# EAGLE design KickerBoard6B (EAGLE 6.5.0)
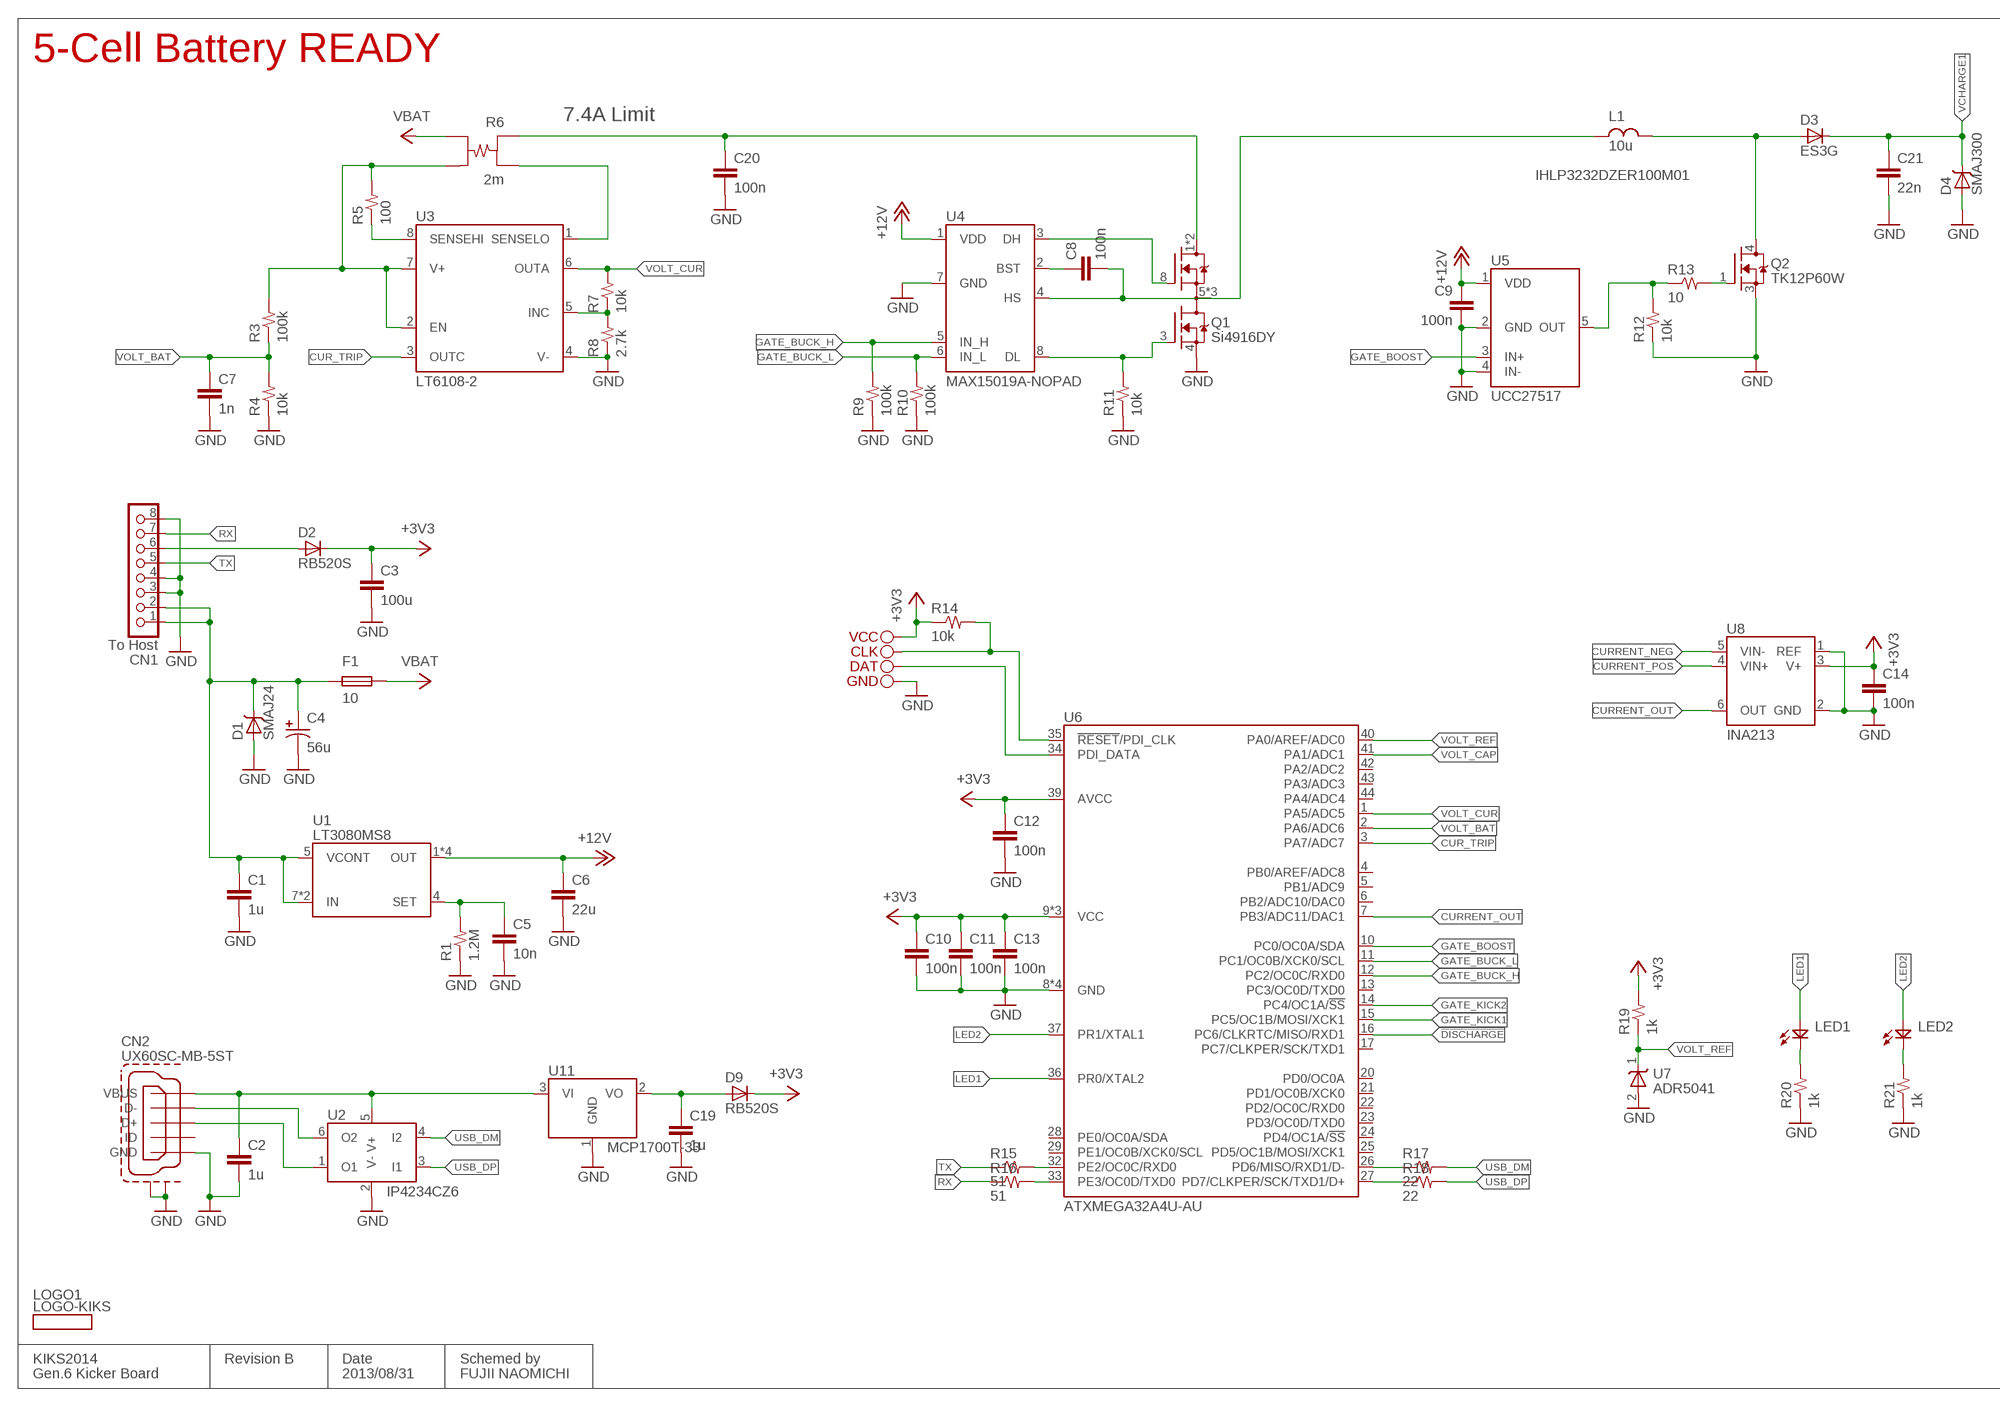
[diagram p0: schematic, sheet 1, part 1 of 2]
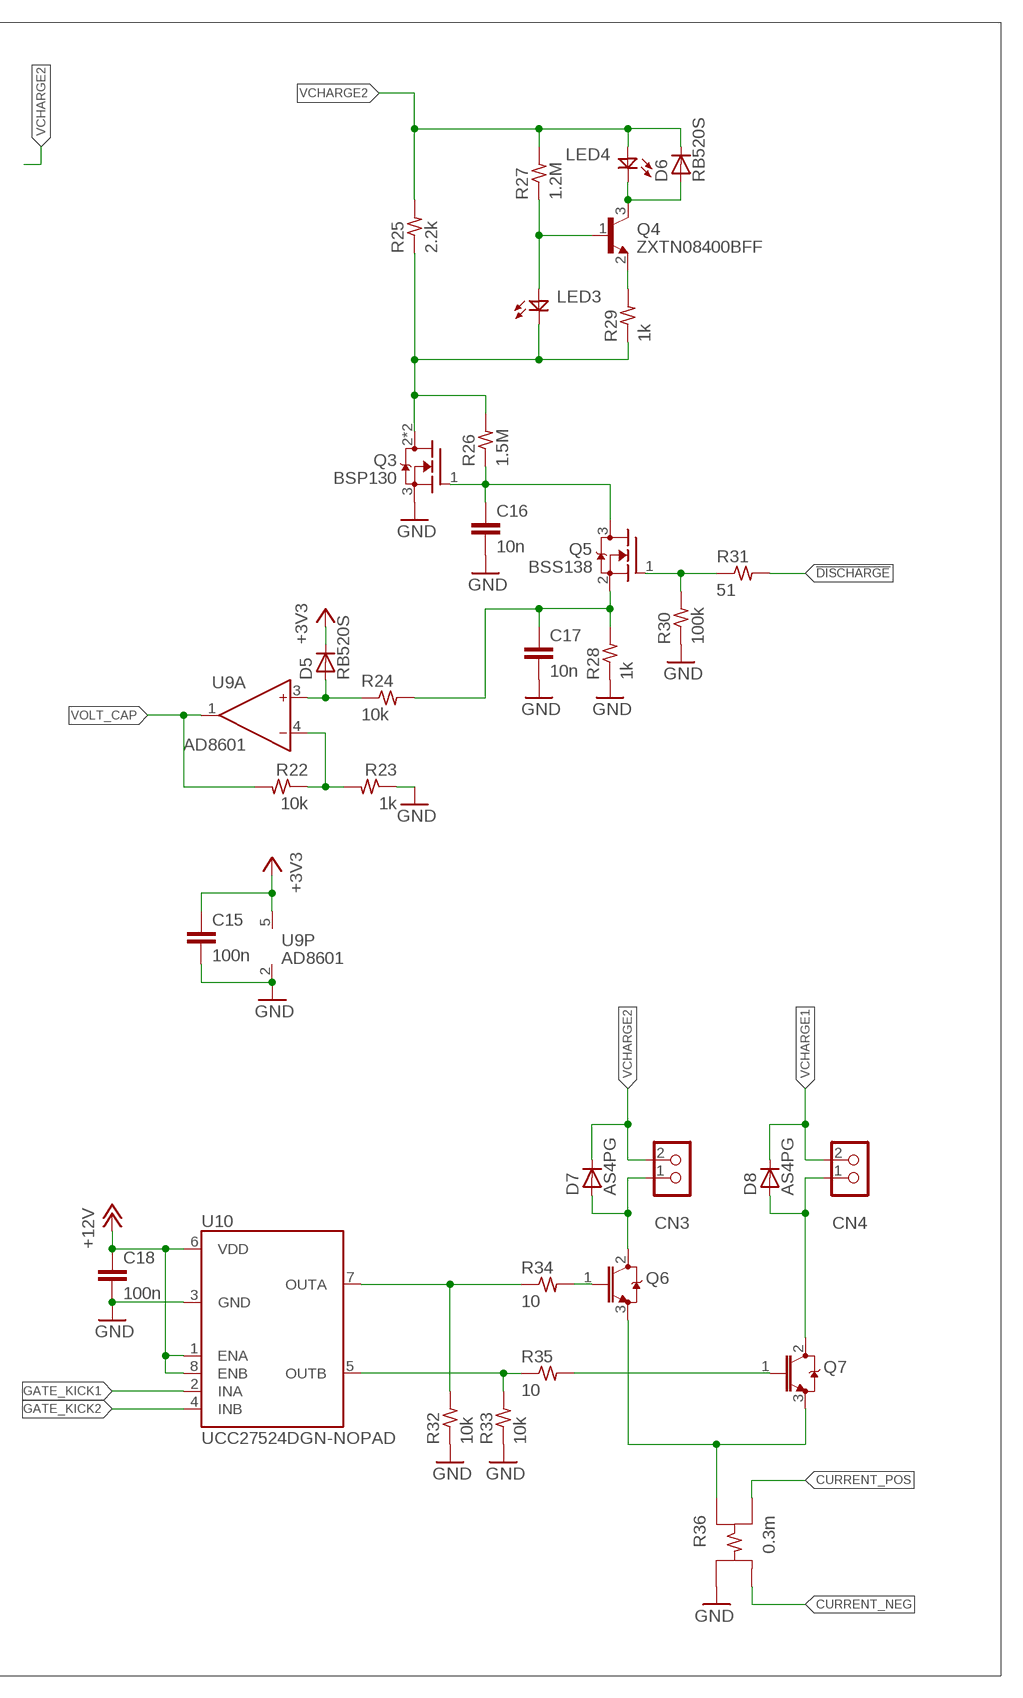
[diagram p1: schematic, sheet 1, part 2 of 2]

## Parts
C1  1u  C1608  [1608]
C2  1u  C1005  [1005]
C3  100u  C3225  [3225]
C4  56u  CPOLS-6.3  [ES-6.3]
C5  10n  C1005  [1005]
C6  22u  C3216  [3216]
C7  1n  C1005  [1005]
C8  100n  C1608  [1608]
C9  100n  C1608  [1608]
C10  100n  C1005  [1005]
C11  100n  C1005  [1005]
C12  100n  C1005  [1005]
C13  100n  C1005  [1005]
C14  100n  C1005  [1005]
C15  100n  C1005  [1005]
C16  10n  C1005  [1005]
C17  10n  C1005  [1005]
C18  100n  C1608  [1608]
C19  1u  C1005  [1005]
C20  100n  C1608  [1608]
C21  22n  C3216  [3216]
CN1  To Host  43650-0800  [43650-0800]
CN2  UX60SC-MB-5ST  [UX60SC-MB-5ST]
CN3  5569-02A2  [5569-02A2]
CN4  5569-02A2  [5569-02A2]
D1  SMAJ24  ZENER-DO-214AC  [DO-214AC]
D2  RB520S  DIODE-1608  [1608]
D3  ES3G  DIODE-DO-214AB  [DO-214AB]
D4  SMAJ300  ZENER-DO-214AC  [DO-214AC]
D5  RB520S  DIODE-1608  [1608]
D6  RB520S  DIODE-1608  [1608]
D7  AS4PG  DIODE-SMPC  [SMPC]
D8  AS4PG  DIODE-SMPC  [SMPC]
D9  RB520S  DIODE-1608  [1608]
F1  10  F3216  [3216]
L1  10u  L8682  [L8682]
LED1  LED1611R  [1611]
LED2  LED1611R  [1611]
LED3  LED1608  [1608]
LED4  LED1608  [1608]
LOGO1  LOGO-KIKS  [LOGO-KIKS]
P1  VCC  PAD  [PAD]
P2  CLK  PAD  [PAD]
P3  DAT  PAD  [PAD]
P4  GND  PAD  [PAD]
Q1  Si4916DY  MOS-2N-BRIDGE-SOP8  [SOP8]
Q2  TK12P60W  MOS-N-DPAK  [DPAK-3]
Q3  BSP130  MOS-N-SOT223  [SOT223]
Q4  ZXTN08400BFF  NPN-SOT23  [SOT23-3]
Q5  BSS138  MOS-N-SOT23  [SOT23-3]
Q6  IGBT-1N  [TO-247AD_X1]
Q7  IGBT-1N  [TO-247AD_X1]
R1  1.2M  R1608  [1608]
R3  100k  R1608  [1608]
R4  10k  R1608  [1608]
R5  100  R1608  [1608]
R6  2m  FC4L  [FC4L]
R7  10k  R1608  [1608]
R8  2.7k  R1608  [1608]
R9  100k  R1005  [1005]
R10  100k  R1005  [1005]
R11  10k  R1005  [1005]
R12  10k  R1005  [1005]
R13  10  R2012  [2012]
R14  10k  R1005  [1005]
R15  51  R1005  [1005]
R16  51  R1005  [1005]
R17  22  R1005  [1005]
R18  22  R1005  [1005]
R19  1k  R1005  [1005]
R20  1k  R1005  [1005]
R21  1k  R1005  [1005]
R22  10k  R1608  [1608]
R23  1k  R1608  [1608]
R24  10k  R1005  [1005]
R25  2.2k  R-S-3  [RIEDON-S-3]
R26  1.5M  R1608  [1608]
R27  1.2M  R1608  [1608]
R28  1k  R1608  [1608]
R29  1k  R1005  [1005]
R30  100k  R1005  [1005]
R31  51  R1005  [1005]
R32  10k  R1005  [1005]
R33  10k  R1005  [1005]
R34  10  R2012  [2012]
R35  10  R2012  [2012]
R36  0.3m  R4-WSL4026  [WSL4026]
U1  LT3080MS8  [MSOP8-PAD]
U2  IP4234CZ6  TPD2S017  [SOT23-6]
U3  LT6108-2  [MSOP8]
U4  MAX15019A-NOPAD  [SOP8]
U5  UCC27517  [SOT23-5]
U6  ATXMEGA32A4U-AU  [QFP44-0.8]
U7  ADR5041  [SC70-3]
U8  INA213  [SC70-6]
U9  AD8601  SINGLE-OPAMP-ISO-SOT23  [SOT23-5]
U10  UCC27524DGN-NOPAD  [MSOP8]
U11  MCP1700T-33  [SOT23-3]

## Nets
!DISCHARGE: R31.2 U6.16(PC6/CLKRTC/MISO/RXD1)
+3V3: C3.1 C10.1 C11.1 C12.1 C13.1 C14.1 C15.1 D2.K D5.K D9.K P1.1 R14.1 R19.2 U6.9(VCC) U6.19(VCC) U6.31(VCC) U6.39(AVCC) U8.3(V+) U9.5(P:V+)
+12V: C6.1 C9.1 C18.1 U1.1(OUT) U1.2(OUT) U1.3(OUT) U1.PAD(OUT) U4.1(VDD) U5.1(VDD) U10.1(ENA) U10.6(VDD) U10.8(ENB)
CUR_TRIP: U3.3(OUTC) U6.3(PA7/ADC7)
CURRENT_NEG: R36.I2 U8.5(VIN-)
CURRENT_OUT: U6.7(PB3/ADC11/DAC1) U8.6(OUT)
CURRENT_POS: R36.I1 U8.4(VIN+)
GATE_BOOST: U5.3(IN+) U6.10(PC0/OC0A/SDA)
GATE_BUCK_H: R9.2 U4.5(IN_H) U6.12(PC2/OC0C/RXD0)
GATE_BUCK_L: R10.2 U4.6(IN_L) U6.11(PC1/OC0B/XCK0/SCL)
GATE_KICK1: U6.15(PC5/OC1B/MOSI/XCK1) U10.2(INA)
GATE_KICK2: U6.14(PC4/OC1A/!SS) U10.4(INB)
GND: C1.2 C2.2 C3.2 C4.N C5.2 C6.2 C7.2 C9.2 C10.2 C11.2 C12.2 C13.2 C14.2 C15.2 C16.2 C17.2 C18.2 C19.2 C20.2 C21.2 CN1.3 CN1.4 CN1.8 CN2.5(GND) CN2.S1 CN2.S2 D1.A D4.A P4.1 Q1.4(S2) Q2.3(S) Q3.3(S) R1.1 R4.1 R8.1 R9.1 R10.1 R11.1 R12.1 R20.1 R21.1 R23.1 R28.1 R30.1 R32.1 R33.1 R36.V2 U2.2(V-) U3.4(V-) U4.7(GND) U5.2(GND) U5.4(IN-) U6.8(GND) U6.18(GND) U6.30(GND) U6.38(GND) U7.2(A) U8.1(REF) U8.2(GND) U9.2(P:V-) U10.3(GND) U11.1(GND)
LED1: LED1.A U6.36(PR0/XTAL2)
LED2: LED2.A U6.37(PR1/XTAL1)
N$1: CN3.1 D7.1(A) D7.2(A) Q6.2(C)
N$2: Q6.1(G) R34.2
N$3: R33.2 R35.1 U10.5(OUTB)
N$4: R32.2 R34.1 U10.7(OUTA)
N$5: CN4.1 D8.1(A) D8.2(A) Q7.2(C)
N$6: C8.2 L1.1 Q1.5(S1_D2) Q1.6(S1_D2) Q1.7(S1_D2) U4.4(HS)
N$7: Q6.3(E) Q7.3(E) R36.V1
N$8: D3.A L1.2 Q2.4(D)
N$9: C20.1 Q1.1(D1) Q1.2(D1) R6.V1
N$10: C5.1 R1.2 U1.4(SET)
N$12: C17.1 Q5.2(S) R24.2 R28.2
N$13: CN1.6 D2.A
N$14: C1.1 C4.P CN1.1 CN1.2 D1.K F1.1 U1.5(VCONT) U1.7(IN) U1.8(IN)
N$15: Q1.8(G1) U4.3(DH)
N$16: Q1.3(G2) R11.2 U4.8(DL)
N$17: C8.1 U4.2(BST)
N$18: R15.2 U6.32(PE2/OC0C/RXD0)
N$19: R16.2 U6.33(PE3/OC0D/TXD0)
N$20: R17.1 U6.26(PD6/MISO/RXD1/D-)
N$21: R18.1 U6.27(PD7/CLKPER/SCK/TXD1/D+)
N$22: CN2.2(D-) U2.6(O2)
N$23: CN2.3(D+) U2.1(O1)
N$24: P2.1 R14.2 U6.35(!RESET!/PDI_CLK)
N$25: C2.1 CN2.1(VBUS) U2.5(V+) U11.3(VI)
N$26: P3.1 U6.34(PDI_DATA)
N$27: LED1.K R20.2
N$28: LED2.K R21.2
N$29: C16.1 Q3.1(G) Q5.3(D) R26.1
N$30: LED3.K Q3.2(D) Q3.4(D) R25.1 R26.2 R29.1
N$31: R22.1 R23.2 U9.4(A:IN-)
N$32: Q5.1(G) R30.2 R31.1
N$33: D5.A R24.1 U9.3(A:IN+)
N$34: D6.A LED4.K Q4.3(C)
N$35: LED3.A Q4.1(B) R27.1
N$36: Q4.2(E) R29.2
N$39: C19.1 D9.A U11.2(VO)
N$43: R5.1 U3.8(SENSEHI)
N$45: Q7.1(G) R35.2
N$48: R6.I1 U3.1(SENSELO)
N$49: R7.1 R8.2 U3.5(INC)
N$57: Q2.1(G) R13.2
N$58: R3.2 R5.2 R6.I2 U3.2(EN) U3.7(V+)
N$59: R12.2 R13.1 U5.5(OUT)
RX: CN1.7 R16.1
TX: CN1.5 R15.1
USB_DM: R17.2 U2.4(I2)
USB_DP: R18.2 U2.3(I1)
VBAT: F1.2 R6.V2
VCHARGE1: C21.1 CN4.2 D3.K D4.K D8.K
VCHARGE2: CN3.2 D6.K D7.K LED4.A R25.2 R27.2
VOLT_BAT: C7.1 R3.1 R4.2 U6.2(PA6/ADC6)
VOLT_CAP: R22.2 U6.41(PA1/ADC1) U9.1(A:OUT)
VOLT_CUR: R7.2 U3.6(OUTA) U6.1(PA5/ADC5)
VOLT_REF: R19.1 U6.40(PA0/AREF/ADC0) U7.1(K)
Unconnected: CN2.4(ID) U6.4(PB0/AREF/ADC8) U6.5(PB1/ADC9) U6.6(PB2/ADC10/DAC0) U6.13(PC3/OC0D/TXD0) U6.17(PC7/CLKPER/SCK/TXD1) U6.20(PD0/OC0A) U6.21(PD1/OC0B/XCK0) U6.22(PD2/OC0C/RXD0) U6.23(PD3/OC0D/TXD0) U6.24(PD4/OC1A/!SS) U6.25(PD5/OC1B/MOSI/XCK1) U6.28(PE0/OC0A/SDA) U6.29(PE1/OC0B/XCK0/SCL) U6.42(PA2/ADC2) U6.43(PA3/ADC3) U6.44(PA4/ADC4)

## Notes on the sheet
- 5-Cell Battery READY
- 7.4A Limit
- IHLP3232DZER100M01
- KIKS2014 | Revision B | Date | Schemed by
- Gen.6 Kicker Board | 2013/08/31 | FUJII NAOMICHI

## Library data of the parts
C1-C3 C5-C21 = Passive:C
C4 = Passive:CPOL
CN1 = con-Molex:43650-0800
CN2 = con-Hirose:UX60S
CN3 CN4 = con-Molex:5569-02A2
D1 D4 = Diode:ZENER-*
D2 D3 D5-D9 = Diode:DIODE-*
F1 = Passive:F
L1 = Passive:L
LED1-LED4 = Opto:LED
LOGO1 = Logo:LOGO-KIKS
P1-P4 = ic-package:PAD
Q1 = ProjectOnly:MOS-2N-BRIDGE
Q2 Q3 Q5 = Transistor:MOS-N-*
Q4 = Transistor:NPN-
Q6 Q7 = ProjectOnly:IGBT-1N
R1 R3-R5 R7-R24 R26-R35 = Passive:R
R6 = ProjectOnly:FC4L
R25 = ProjectOnly:R-*
R36 = ProjectOnly:R4-
U1 = ic-LT:LT3080
U2 = ic-TI:TPD2S017
U3 = ic-LT:LT6108-2
U4 = ic-Maxim:MAX1501*A; INPUT: TTL
U5 = ic-TI:UCC27517
U6 = ic-ATMEL:ATXMEGA*A4U
U7 = ic-AD:ADR504*
U8 = ic-TI:INA21*; GAIN: 50
U9 = Opamp:SINGLE-OPAMP-ISO
U10 = ic-TI:UCC27524
U11 = ic-Microchip:MCP1700T-*

## Board
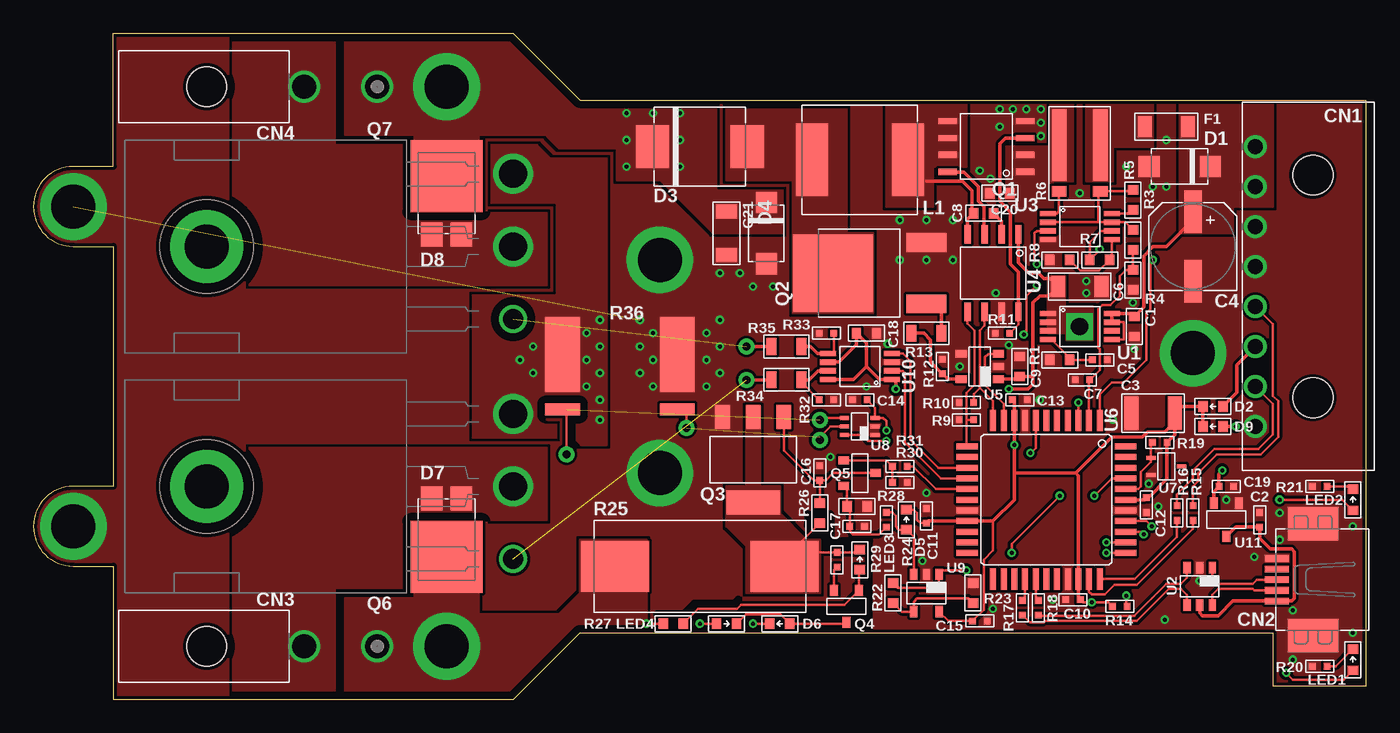
[diagram p2: board, top side]
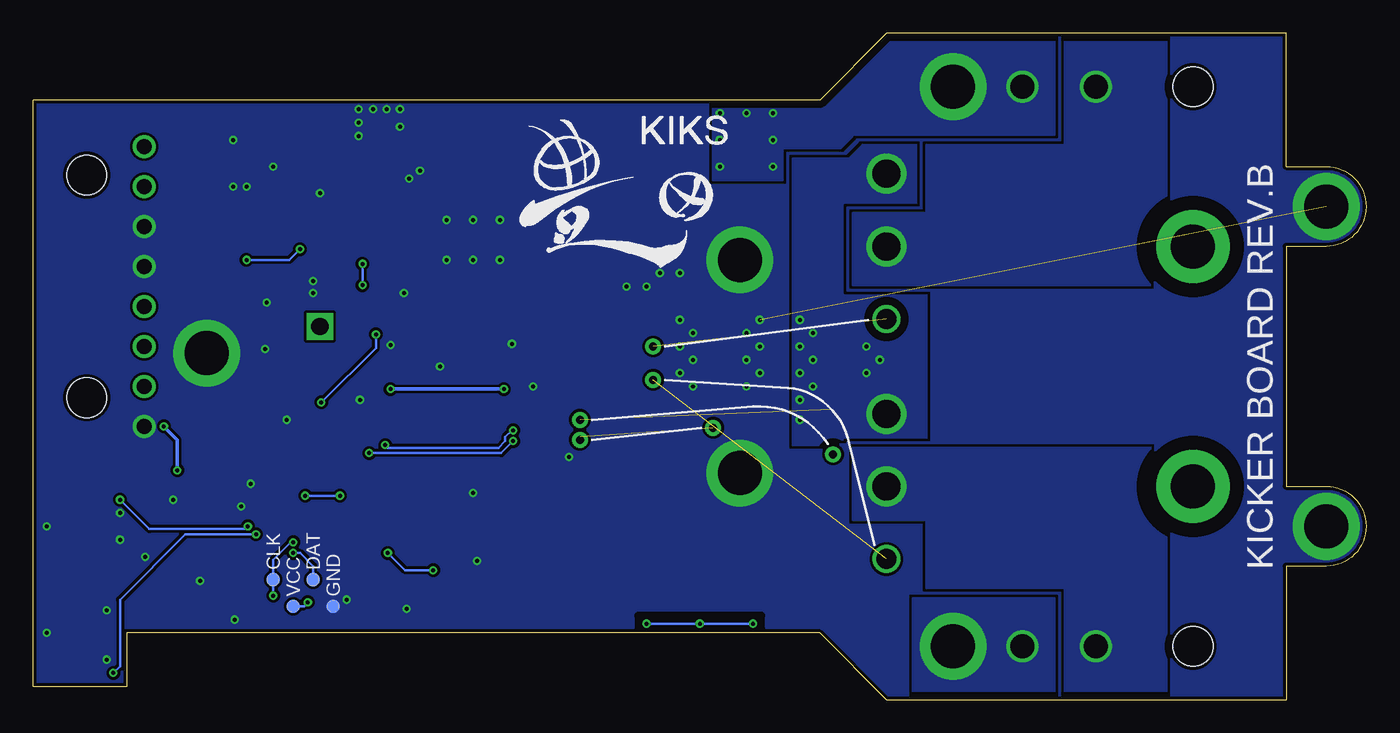
[diagram p3: board, bottom side, seen from below]

Size 100 x 50 mm. Coordinates in mm from the lower left corner, seen from the top.
Outline: 100,1 100,45 41,45 36,50 6,50 6,40 3,40 arc180 3,34 6,34 6,16 3,16 arc180 3,10 6,10 6,0 36,0 41,5 93,5 93,1 100,1
Copper layers (1*16): Top 0.035mm / dielectric 1.6mm / Bottom 0.035mm
Design rules "seeedstudio": minimum track width 6mil, minimum drill 0.3mm, track to track 6mil, track to pad 6mil, pad to pad 6mil, via to via 6mil, smd to smd 6mil, copper to edge 10mil, drill to drill 10mil, minimum pad ring 0.2mm, minimum via ring 6mil, stop-mask expansion 4mil, vias tented up to drill 3mm, thermal gap 10mil
tRestrict: area 9.5,30.5 to 16.5,37.5; area 9.5,12.5 to 16.5,19.5; 9 lines
bRestrict: area 9.5,30.5 to 16.5,37.5; area 9.5,12.5 to 16.5,19.5; 3 lines

### Footprints (pad centres in the part's own frame; a part is rotated, then mirrored left to right if it is on the bottom)
1608 = smd 0.7 x 0.8: 1 -0.75,0; 2 0.75,0
1005 = smd 0.5 x 0.5: 1 -0.55,0; 2 0.55,0
3225 = smd 1.05 x 2.5: 1 -1.625,0; 2 1.625,0
ES-6.3 = smd 3.2 x 1.3: N 2.6,0; P -2.6,0
3216 = smd 1.05 x 1.6: 1 -1.625,0; 2 1.625,0
43650-0800 = drill 1.1 pad 1.7: 1 -10.5,-4.32; 2 -7.5,-4.32; 3 -4.5,-4.32; 4 -1.5,-4.32; 5 1.5,-4.32; 6 4.5,-4.32; 7 7.5,-4.32; 8 10.5,-4.32 | hole 3: 8.35,0; -8.35,0
UX60SC-MB-5ST = smd 1.8 x 0.5: 1 2.7,1.6; 2 2.7,0.8; 3 2.7,0; 4 2.7,-0.8; 5 2.7,-1.6 | smd 3.8 x 2.5: S1 0,-4.2; S2 0,4.2
5569-02A2 = drill 1.8 pad 2.4: 1 0,-7.3; 2 0,-12.8 | hole 3: 0,0
DO-214AC = smd 1.6 x 1.6: A 2.3,0; K -2.3,0
1608' = smd 0.7 x 0.8: A 0.75,0; K -0.75,0
DO-214AB = smd 2.5 x 3.2: A 3.55,0; K -3.55,0
SMPC = smd 1.6 x 1.8: 1 1.1,-3.1; 2 -1.1,-3.1 | smd 5.4 x 5.4: K 0,1.3
L8682 = smd 2.4 x 5.4: 1 -3.6,0; 2 3.6,0
1611 = smd 0.7 x 0.8: A 0.8,0; K -0.8,0
PAD = smd 1 x 1: 1 0,0
SOP8 = smd 0.48 x 1.4: 1 -1.905,-2.9; 2 -0.635,-2.9; 3 0.635,-2.9; 4 1.905,-2.9; 5 1.905,2.9; 6 0.635,2.9; 7 -0.635,2.9; 8 -1.905,2.9
DPAK-3 = smd 1.4 x 3: 1 -2.3,-2; 3 2.3,-2 | smd 5.8 x 6: 4 0,5
SOT223 = smd 1.1 x 1.8: 1 -2.3,-3.2; 2 0,-3.2; 3 2.3,-3.2 | smd 4 x 1.8: 4 0,3.2
SOT23-3 = smd 0.6 x 0.8: 1 -0.95,-1.2; 2 0.95,-1.2; 3 0,1.2
TO-247AD_X1 = drill 1.5 pad 2.1: 1 -5.45,-8 | drill 2.1 pad 3: 2 0,-8; 3 5.45,-8 | drill 3.3 pad 5.5: S 0,15
FC4L = smd 1.1 x 0.8: I1 -1.55,-2.85; I2 1.55,-2.85 | smd 1.1 x 5.4: V1 -1.55,0.6; V2 1.55,0.6
2012 = smd 0.75 x 1.25: 1 -1.125,0; 2 1.125,0
RIEDON-S-3 = smd 5.1 x 3.8: 1 -6.35,0; 2 6.35,0
WSL4026 = smd 2.6 x 0.89: I1 -4.3,-3.235; I2 4.3,-3.235 | smd 2.6 x 5.6: V1 -4.3,0.9; V2 4.3,0.9
MSOP8-PAD = smd 0.4 x 1.2: 1 -0.975,-2.4; 2 -0.325,-2.4; 3 0.325,-2.4; 4 0.975,-2.4; 5 0.975,2.4; 6 0.325,2.4; 7 -0.325,2.4; 8 -0.975,2.4 | drill 1.3 pad 2 square: PAD 0,0
SOT23-6 = smd 0.55 x 0.85: 1 -0.95,-1.4; 2 0,-1.4; 3 0.95,-1.4; 4 0.95,1.4; 5 0,1.4; 6 -0.95,1.4
MSOP8 = smd 0.4 x 1.2: 1 -0.975,-2.4; 2 -0.325,-2.4; 3 0.325,-2.4; 4 0.975,-2.4; 5 0.975,2.4; 6 0.325,2.4; 7 -0.325,2.4; 8 -0.975,2.4
SOT23-5 = smd 0.55 x 0.85: 1 -0.95,-1.4; 2 0,-1.4; 3 0.95,-1.4; 4 0.95,1.4; 5 -0.95,1.4
QFP44-0.8 = smd 1.6 x 0.45: 1 -5.95,4; 2 -5.95,3.2; 3 -5.95,2.4; 4 -5.95,1.6; 5 -5.95,0.8; 6 -5.95,0; 7 -5.95,-0.8; 8 -5.95,-1.6; 9 -5.95,-2.4; 10 -5.95,-3.2; 11 -5.95,-4; 23 5.95,-4; 24 5.95,-3.2; 25 5.95,-2.4; 26 5.95,-1.6; 27 5.95,-0.8; 28 5.95,0; 29 5.95,0.8; 30 5.95,1.6; 31 5.95,2.4; 32 5.95,3.2; 33 5.95,4 | smd 0.45 x 1.6: 12 -4,-5.95; 13 -3.2,-5.95; 14 -2.4,-5.95; 15 -1.6,-5.95; 16 -0.8,-5.95; 17 0,-5.95; 18 0.8,-5.95; 19 1.6,-5.95; 20 2.4,-5.95; 21 3.2,-5.95; 22 4,-5.95; 34 4,5.95; 35 3.2,5.95; 36 2.4,5.95; 37 1.6,5.95; 38 0.8,5.95; 39 0,5.95; 40 -0.8,5.95; 41 -1.6,5.95; 42 -2.4,5.95; 43 -3.2,5.95; 44 -4,5.95
SC70-3 = smd 0.3 x 0.7: 1 -0.65,-1.15; 2 0.65,-1.15; 3 0,1.15
SC70-6 = smd 0.3 x 0.7: 1 -0.65,-1.15; 2 0,-1.15; 3 0.65,-1.15; 4 0.65,1.15; 5 0,1.15; 6 -0.65,1.15
SOT23-3' = smd 0.6 x 0.85: 1 -0.95,-1.25; 2 0.95,-1.25; 3 0,1.25

### Placement (x,y rotation side)
C1  82.6,28 270 top
C2  92,13.5 90 top
C3  84,21.5 180 top
C4  87,34 270 top
C5  80,25.5 0 top
C6  78.5,31 0 top
C7  78.7,24 180 top
C8  71.3,36.5 180 top
C9  74,25 90 top
C10  78,7.5 180 top
C11  67,13.8 90 top
C12  83.5,14.6 270 top
C13  74,22.5 0 top
C14  62,22.5 180 top
C15  71,5.9 0 top
C16  59,17 90 top
C17  61.8,13 0 top
C18  62.5,27.5 0 top
C19  89.5,16 0 top
C20  72.5,38 180 top
C21  52,35 270 top
CN1  96,31 270 top
CN2  96,9 180 top
CN3  13,4 90 top
CN4  13,46 90 top
D1  86,40 180 top
D2  RB520S  [1608']  88.5,22 0 top
D3  50,41.5 0 top
D4  55,35 270 top
D5  RB520S  [1608']  65.5,13.5 270 top
D6  RB520S  [1608']  56,5.7 0 top
D7  31,12 180 top
D8  31,38 0 top
D9  RB520S  [1608']  88.5,20.5 0 top
F1  85,43 180 top
L1  62,40.5 180 top
LED1  99,3 270 top
LED2  99,15 270 top
LED3  [1608']  62,10.5 270 top
LED4  [1608']  52,5.7 180 top
LOGO1  64,32 0 bottom
P1  80.5,7 90 bottom
P2  82,9 90 bottom
P3  79,9 90 bottom
P4  77.5,7 90 bottom
Q1  71.5,41.5 90 top
Q2  65,32 90 top
Q3  54,18 180 top
Q4  61,7 180 top
Q5  62,17 270 top
Q6  28,16 90 top
Q7  28,34 90 top
R1  77,25.5 0 top
R3  82.5,34.5 90 top
R4  82.5,31.5 90 top
R5  82.5,37.5 90 top
R6  78.5,41 0 top
R7  80,33 180 top
R8  77,33 0 top
R9  70,21 0 top
R10  70,22.3 0 top
R11  72.7,27.5 0 top
R12  68.2,25 270 top
R13  67,27.5 0 top
R14  81.5,7 0 top
R15  87,14 270 top
R16  85.8,14 270 top
R17  74.2,6.9 270 top
R18  75.4,6.9 270 top
R19  84.5,19.3 0 top
R20  96.5,2.5 0 top
R21  96.5,16 0 top
R22  64.5,8 90 top
R23  70.5,8 270 top
R24  64,13.5 270 top
R25  50,10 180 top
R26  59,14 270 top
R27  48,5.7 180 top
R28  61.8,14.5 180 top
R29  60.3,10.5 270 top
R30  65,16.3 180 top
R31  65,17.5 0 top
R32  59.5,22.5 180 top
R33  59.5,27.5 0 top
R34  56.5,24 180 top
R35  56.5,26.5 180 top
R36  44,25 0 top
U1  78.5,28 270 top
U2  87.5,8.5 180 top
U3  78.5,35.5 270 top
U4  72,32 180 top
U5  71,25 90 top
U6  76,15 270 top
U7  85,17.5 270 top
U8  62,20.5 90 top
U9  67,8 180 top
U10  62,25 90 top
U11  MCP1700T-33  [SOT23-3']  89.5,13.5 180 top

### Tracks (layer width: path | path; a pad name or v marks a point on that pad's centre or on a via)
!DISCHARGE
  Top 0.2: R31.2 66,17.5 67.7,15.8 U6.16
+3V3  (via drill 0.3)
  Top 0.2: 72,13.4 72,11.2 71.3,10.5 71.3,6.75 C15.1 68.65,5.9 U9.5 | C14.1 63.15,21.9 U8.3 63.75,21.15 64,20.9 v64,20.2 | C10.1 78.75,7.3 v79.4,7.3 80.65,7.3 R14.1 | D5.K 66.05,14.25 66.3,14 66.3,13.5 66.55,13.25 C11.1
  Top 0.25: 78.2,17 73.6,17 | 73.6,17 v73.6,19.1 U6.9 73.6,22.35 C13.1 | 78.2,17 78.4,16.8 U6.31 78.4,7.65 C10.1 | 73.6,17 73.6,15 72,13.4 U6.19 67.15,13.4 C11.1 | U6.39 83.35,15 C12.1 83.65,15.15 85.05,16.55 R19.2 85.62,19.88 85.62,20.82 | 78.2,17 80.9,19.7 83.2,19.7 83.6,20.1 84.9,20.1 85.62,20.82 | 85.62,20.82 C3.1 86.12,22 D2.K D9.K
  Bottom 0.2: v64,20.2 64.1,20.2 64.6,19.7 64.6,19.4 65.1,18.9 73.4,18.9 v73.6,19.1 | P1.1 79.7,7 v79.4,7.3
+12V  (via drill 0.3)
  Top 0.25: U4.1 73.91,32.8 74.7,32 75.4,32 75.8,31.6 76.28,31.6 C6.1 76.17,30.3 75.5,30.3 75,29.8 75,24.25 | U1.1 76.5,28.98 | U10.6 60.42,25.32 61.75,26.65 C18.1 62.5,26.75 62.5,25 | 62.5,25 63.48,24.02 U10.1 64.7,24.02 v64.7,23.3 | U10.8 61.52,24.02 62.5,25 | v73.2,23.3 74.6,23.3 75,23.7 75,24.25 | 75,24.25 C9.1 73.8,24.05 U5.1
  Bottom 0.25: v73.2,23.3 v64.7,23.3
  pour Top (isolate 0.2, no thermals): 79.5,27 79.5,29.5 77.4,29.5 77.4,31.8 76.1,31.8 76.1,27.5 77.5,27.5 77.5,27
CUR_TRIP  (via drill 0.3)
  Top 0.2: U3.3 75.28,35.17 75.1,35 75.1,32.9 v75.3,32.7 | v75.3,31.1 74.5,30.3 74.5,27.6 v74.3,27.4 | v78.4,22.3 U6.3
  Bottom 0.2: v75.3,32.7 v75.3,31.1 | v78.4,22.3 74.3,26.4 v74.3,27.4
CURRENT_NEG  (via drill 0.6 pad 1.2)  (1 unrouted)
  Top 0.2: v49,20.4 49,21.77 R36.I2 | U8.5 59.8,20.5 59,19.7 v59,19.5
CURRENT_OUT  (via drill 0.3)
  Top 0.2: U8.6 62.15,19.85 62.6,19.4 v64,19.4 | U6.7 75.2,18.9 v74.8,18.5
  Bottom 0.2: v64,19.4 64.9,18.5 v74.8,18.5
CURRENT_POS  (via drill 0.6 pad 1.2)  (1 unrouted)
  Top 0.2: v40,18.4 40,21.77 R36.I1 | U8.4 59.15,21.15 v59,21
GATE_BOOST
  Top 0.2: U5.3 71.65,25.95 71.4,25.7 71.4,23.6 72.8,22.2 U6.10
GATE_BUCK_H
  Top 0.2: U4.5 70.09,28.2 70.6,27.7 70.6,23.6 70,23 70,21 | 70,21 70,19 U6.12 | R9.2 70,21
GATE_BUCK_L
  Top 0.2: U4.6 71.36,28.07 71,27.7 71,23.4 | U6.11 72,22.4 71,23.4 | R10.2 70.55,22.95 71,23.4
GATE_KICK1
  Top 0.2: U10.2 65.22,24.68 65.4,24.5 65.4,19.3 68.1,16.6 U6.15
GATE_KICK2
  Top 0.2: U10.4 65.22,25.98 65.8,25.4 65.8,19.5 67.9,17.4 U6.14
GND  (via drill 0.3, 3.3 pad 5)  (1 unrouted)
  other vias: 47,33 47,17 3,13 3,37 87,26 82.6,26.3 79,30.5 79,31.4 82.5,29.8 84.4,14.5 76.5,7.5 67,15.5 75.5,22.5 74.5,44.3 69,36 67,36 65,36 65,33 67,33 69,33 72.2,30.5 73.2,26.6 82,40 84,38.5 85,38.5 85,42 83.7,16.2 93.5,14 93.5,12 99,13 99,5 94.5,6.7 94.5,3 72,6.8 66.7,10.4 46.5,27.5 45.5,28.5 45.5,26.5 46.5,25.5 45.5,24.5 46.5,23.5 50.5,23.5 51.5,24.5 50.5,25.5 51.5,26.5 50.5,27.5 51.5,28.5 54,31 55.5,31 53,32 51.5,32 84.9,6 62.5,23.5 64.1,26.7 69.5,25 59.8,18.2 81,21 91.6,10.7 87.5,8.9 89.5,15 75.6,44.3 75.6,43.3 75.6,42.3 72.5,44.3 73.5,44.3 72.5,43 78.5,38 71,39.7 71.8,39.1
  pour Top (isolate 0.2, rank 6, no thermals): -1,53 -1,-3 101,-3 101,53
  pour Bottom (isolate 0.2, rank 6, no thermals): -2,54 102,54 102,-4 -2,-4
LED1  (via drill 0.3)
  Top 0.2: U6.36 83.1,12.6 v83.3,12.4 | v94,2 94.5,1.5 98.3,1.5 LED1.A
  Bottom 0.2: v83.3,12.4 88.6,12.4 93.5,7.5 93.5,2.5 v94,2
LED2  (via drill 0.3)
  Top 0.2: U6.37 83.5,13.4 v83.9,13 | LED2.A 98.2,15 v93.5,15
  Bottom 0.2: v83.9,13 84.1,12.8 91.3,12.8 v93.5,15
N$1
  pour Top (isolate 0.6, no thermals): 22.6,-1 22.6,8.4 28,8.4 28,13.5 38.5,13.5 38.5,18.9 15,18.9 15,-1
  pour Bottom (isolate 0.6, no thermals): 15,-2 15,18.9 38.5,18.9 38.5,13.5 33,13.5 33,8.4 22.6,8.4 22.6,-2
N$2  (via drill 0.6 pad 1.2)  (1 unrouted)
  Top 0.25: R34.2 v53.5,24
N$3
  Top 0.2: R33.2 60.05,25.98 U10.5
  Top 0.25: U10.5 58.83,25.98 58.3,26.5 R35.1
N$4
  Top 0.2: R34.1 57.62,23.82 R32.2
  Top 0.25: U10.7 58.88,24.68 58.2,24 R34.1
N$5
  pour Top (isolate 0.6, no thermals): 22.6,51 22.6,41.6 28,41.6 28,37.4 33.4,37.4 33.4,36.5 38.5,36.5 38.5,31.1 15,31.1 15,51
  pour Bottom (isolate 0.6, no thermals): 15,52 15,31.1 38.5,31.1 38.5,36.5 33,36.5 33,41.6 22.6,41.6 22.6,52
N$6
  Top 0.25: U4.4 70.09,36.05 C8.2 70.55,36.65 70.4,36.8 70.4,38.2 69.7,38.9 67,38.9
  pour Top (isolate 0.2, no thermals): 64,46 64,37 67.5,37 67.5,40 70,40 70,46
N$7  (via drill 0.3)
  other vias: 37.5,26.5 36.5,25.5 37.5,24.5 41.5,27.5 42.5,26.5 42.5,24.5 41.5,23.5 42.5,22.5 41.5,25.5 42.5,28.5 42.5,21
  pour Top (isolate 0.6, rank 2, no thermals): 34,41.6 34,36.7 38.7,36.7 38.7,30.9 33,30.9 33,19.1 43,19.1 43,40.6 38.8,40.6 37.8,41.6
  pour Bottom (isolate 0.6, rank 2, no thermals): 33,41.6 33.1,36.7 38.7,36.7 38.7,30.9 33,30.9 33,19.1 43,19.1 43,40.6 38.8,40.6 37.8,41.6
N$8
  pour Top (isolate 0.6, no thermals): 63,29 63,35 61,35 61,46 52,46 52,39 57,39 57,29
N$9
  pour Top (isolate 0.2, rank 2, no thermals): 78,46 78,38.9 76.5,38.9 76.5,35 75,35 75,32 74,32 74,35 73,35 73,41.5 76.3,41.5 76.3,46
N$10
  Top 0.2: U1.4 76.38,27.02 77.75,25.65 R1.2 C5.1
N$12
  Top 0.2: R24.2 63.45,12.4 61.5,12.4 61.25,12.65 C17.1 61.25,14.3 R28.2 61.05,15.8 Q5.2
N$13
  Top 0.25: CN1.6 90.3,25.12 90.3,23.05 D2.A
N$14
  Top 0.2: U1.5 81.8,27.02 81.8,28.32 U1.7
  Top 0.25: U1.7 U1.8 82.38,28.98 C1.1 83.3,29.45 83.3,33.3 84,34 85,34 87,36 C4.P
  pour Top (isolate 0.2, no thermals): 86,46 86,35 90,35 90,37 93,37 93,46
N$15
  Top 0.25: U4.3 71.3,34.97 71.3,37 70.9,37.4 70.9,38.5 69.81,39.59 Q1.8
N$16
  Top 0.2: U4.8 73.91,28.16 R11.2
  Top 0.25: Q1.3 72.94,42.13 72.5,41.7 72.5,37.4 73.3,36.6 73.3,32.7 73.91,32.09 U4.8
N$17
  Top 0.25: U4.2 72.64,35.91 C8.1
N$18
  Top 0.2: U6.32 79.2,8.1 79.4,7.9 80.4,7.9 81.1,8.6 82.8,8.6 87,12.8 R15.2
N$19
  Top 0.2: U6.33 82.65,9.05 85.8,12.2 R16.2
N$20
  Top 0.2: U6.26 74.4,7.65 R17.1
N$21
  Top 0.2: U6.27 75.2,7.65 R18.1
N$22
  Top 0.2: CN2.2 91.6,8.2 91.5,8.3 88.9,8.3 88.45,7.85 U2.6
N$23
  Top 0.2: CN2.3 91.8,9 91.5,8.7 88.9,8.7 88.45,9.15 U2.1
N$24  (via drill 0.3)
  Top 0.2: v82,7.8 82,7.05 R14.2 | v80.5,11.8 U6.35
  Bottom 0.2: v82,7.8 P2.1 82,10.5 80.7,11.8 v80.5,11.8
N$25
  Top 0.25: U11.3 90.2,12.95 C2.1 92,12.1 92.8,11.3 94.4,11.3 94.6,11.1 94.6,7.6 94.4,7.4 CN2.1 90,7.4 88.9,6.3 87.7,6.3 87.5,6.5 U2.5
N$26  (via drill 0.3)
  Top 0.2: v80.5,11 U6.34
  Bottom 0.2: P3.1 79,10 80,11 v80.5,11
N$27
  Top 0.2: R20.2 97.7,2.5 LED1.K
N$28
  Top 0.2: R21.2 98.8,16 LED2.K
N$29
  Top 0.2: Q3.1 56.3,18.7 58.55,16.45 C16.1 | Q5.3 60,17 59.45,16.45 C16.1 | C16.1 R26.1
N$30
  Top 0.2: R26.2 57,11.25 | LED3.K 61.8,11.05 R29.1 57.4,11.05 R25.1
  pour Top (isolate 0.6, no thermals): 52,16 52,13 53.5,11.5 53.5,8 59,8 59,12 58,12 56,14 56,16 54.5,16 54.5,22 53.5,22 53.5,16
N$31
  Top 0.2: R23.2 70.15,7.6 66.3,7.6 66.05,7.35 U9.4 65.15,6.6 R22.1
N$32
  Top 0.2: Q5.1 64,17.95 R31.1 R30.2
N$33
  Top 0.2: R24.1 64.45,14.05 64.7,13.8 64.7,13 64.95,12.75 D5.A 66.05,12.2 U9.3
N$34
  Top 0.2: LED4.K 53.45,6.4 56.05,6.4 D6.A 60.9,5.7 Q4.3
N$35
  Top 0.2: R27.1 49.85,6.8 52.8,6.8 53.1,7.1 60.85,7.1 Q4.1 61.95,9.7 LED3.A
N$36
  Top 0.2: Q4.2 60.05,9.7 R29.2
N$39  (via drill 0.3)
  Top 0.25: U11.2 88.55,15.6 C19.1 88.95,16.95 v89.2,17.2 | D9.A v90.2,20.5
  Bottom 0.25: v89.2,17.2 89.2,19.5 v90.2,20.5
N$43
  Top 0.2: U3.8 82.22,36.48 R5.1
N$45  (via drill 0.6 pad 1.2)  (1 unrouted)
  Top 0.25: R35.2 v53.5,26.5
N$48
  Top 0.2: R6.I1 76.95,36.65 76.78,36.48 U3.1
N$49
  Top 0.2: R8.2 78.55,32.2 79.95,32.2 R7.1 80.9,33.15 U3.5
N$57
  Top 0.25: R13.2 68.12,29.7 Q2.1
N$58
  Top 0.2: R5.2 82.4,38.15 R6.I2 79.9,38 79.9,35.83 | U3.2 79.9,35.83 | 79.9,35.83 U3.7 81.92,35.83 R3.2
N$59
  Top 0.25: R13.1 66.8,27.5 67.3,27 67.3,25.35 R12.2 68.6,24.05 U5.5
RX
  Top 0.2: R16.1 85.8,15.4 87,16.6 87,17.2 88.6,18.8 91.9,18.8 93,19.9 93,22.18 CN1.7
TX
  Top 0.2: CN1.5 93,28.18 93,22.8 93.4,22.4 93.4,19.7 92.1,18.4 88.8,18.4 87.4,17 87.4,16.4 87,16 R15.1
USB_DM
  Top 0.2: R17.2 74.75,5.8 75.8,5.8 75.9,5.9 82.8,5.9 85.2,8.3 86.1,8.3 86.55,7.85 U2.4
USB_DP
  Top 0.2: R18.2 75.45,6.3 82.6,6.3 85,8.7 86.1,8.7 86.55,9.15 U2.3
VBAT
  pour Top (isolate 0.2, no thermals): 84,46 84,41.5 81,41.5 81,38.9 79,38.9 79,46
VCHARGE1  (via drill 0.3, 3.3 pad 5)
  other vias: 31,46 44.5,40 44.5,42 44.5,44 46.5,44 48.5,44 48.5,42 48.5,40
  pour Top (isolate 0.6, rank 3, no thermals): 52,39 52,51 23.4,51 23.4,42.4 28.6,42.4 28.6,37.6 33.4,37.6 33.4,42.4 37.6,42.4 38.6,41.4 43.8,41.4 43.8,39 47,39 51,35 57,35 57,39
  pour Bottom (isolate 0.6, rank 3, no thermals): 49,39 49,52 23.4,52 23.4,42.4 37.6,42.4 38.6,41.4 43.8,41.4 43.8,39
VCHARGE2  (via drill 0.3, 3.3 pad 5)
  Top 0.2: R27.2 v46,5.7 | LED4.A v50,5.7 | D6.K v54,5.7
  Bottom 0.2: v46,5.7 v50,5.7 v54,5.7
  other vias: 31,4
  pour Top (isolate 0.6, rank 3, no thermals): 23.4,-1 23.4,7.6 28.6,7.6 28.6,12.4 33.4,12.4 33.4,6.4 39.4,6.4 41,8 41,12 46,12 46,-1
  pour Bottom (isolate 0.6, rank 2, no thermals): 23.4,7.6 34,7.6 34,-2 23.4,-2
VOLT_BAT
  Top 0.2: R3.1 R4.2 81.95,32.25 81.5,31.8 81.5,30.3 80.8,29.6 80.2,29.6 79.9,29.3 79.9,26.4 80,26.3 80,24.75 C7.1 79.2,23.95 U6.2
VOLT_CAP  (via drill 0.3)
  Top 0.2: v79.6,15.3 80.9,16.6 U6.41 | v73.4,11 73.4,11.7 v77,15.3 | R22.2 64.85,8.4 67.7,8.4 67.95,8.65 U9.1 67.95,9.7 v70,9.7
  Bottom 0.2: v77,15.3 v79.6,15.3 | v70,9.7 72.1,9.7 v73.4,11
VOLT_CUR  (via drill 0.3)
  Top 0.2: U3.6 80.08,35.17 79.25,34.35 R7.2 80,33.75 v80,33.8 | v84,33 83.8,32.8 83.8,29.3 83.5,29 83.5,25.5 81.8,23.8 80.9,23.8 80,22.9 U6.1
  Bottom 0.2: v80,33.8 80.8,33 v84,33
VOLT_REF
  Top 0.2: U6.40 82.9,15.8 83.1,16 83.1,17.1 83.85,17.85 U7.1 83.85,19.2 R19.1

### Text on the board
bPlace: KICKER BOARD REV.B